# Altium schematic sheet LED.SchDoc: LED
size A4; SheetNumber: 5; SheetTotal: 5
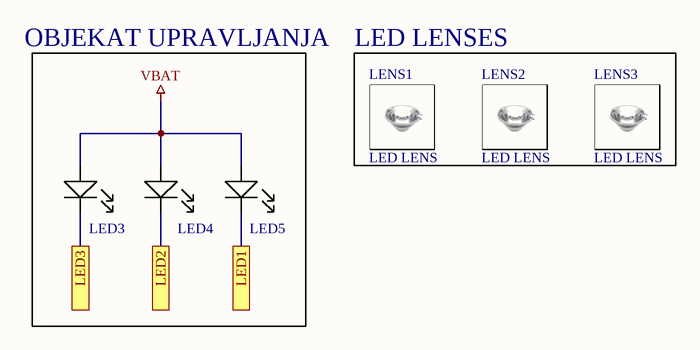
[diagram p0: LED.SchDoc]

## Parts
LED3  JB2835BWT-N-U65EA0000-N000P001  [LED_1411]  (value not drawn)
LED4  JB2835BWT-N-U65EA0000-N000P001  [LED_1411]  (value not drawn)
LED5  JB2835BWT-N-U65EA0000-N000P001  [LED_1411]  (value not drawn)
LENS1  LED LENS  (net tie)
LENS2  LED LENS  (net tie)
LENS3  LED LENS  (net tie)

## Blocks framed on the sheet
LED LENSES: LENS1-LENS3

## Ports
LED1, LED2, LED3

## Nets
VBAT: LED3.1(Anode) LED4.1(Anode) LED5.1(Anode)
LED1: LED5.2(Cathode) ; port LED1
LED2: LED4.2(Cathode) ; port LED2
LED3: LED3.2(Cathode) ; port LED3

## Notes on the sheet
- OBJEKAT UPRAVLJANJA
- Title
- Project
- Size
- Designed By
- Date
- Revision
- A4
- Checked By

## Library data of the parts
LED3-LED5 = LED COOL WHITE: LED Lighting J White, Cool 6500K 3-Step MacAdam Ellipse 2.7V 55mA 120° 1411 (3528 Metric); MPN: JB2835BWT-N-U65EA0000-N000P001
LENS1-LENS3 = LED LENS: LENS CLR 15-33DEG MEDIUM SNAP-IN; MPN: 10003/15